# EAGLE design Sensor Tester (EAGLE 9.4.2)
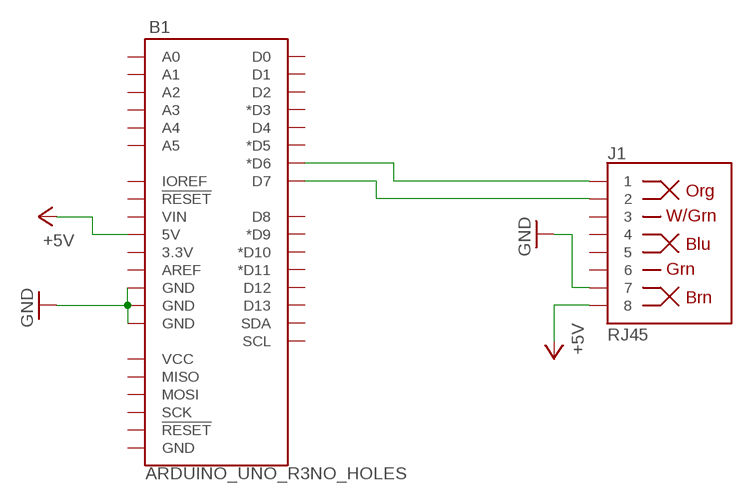
[diagram p0: schematic, sheet 1]

## Parts
B1  ARDUINO_UNO_R3NO_HOLES  [ARDUINO_R3_NO_HOLES]
J1  RJ45  RJ45-8  [RJ45-8]

## Nets
+5V: B1.5V J1.8
GND: B1.GND@2(GND) B1.GND@3(GND) B1.GND@4(GND) J1.7
N$1: B1.D6(*D6) J1.1
N$2: B1.D7 J1.2
Unconnected: B1.3.3V B1.A0 B1.A1 B1.A2 B1.A3 B1.A4 B1.A5 B1.AREF B1.D0 B1.D1 B1.D2 B1.D3(*D3) B1.D4 B1.D5(*D5) B1.D8 B1.D9(*D9) B1.D10(*D10) B1.D11(*D11) B1.D12 B1.D13 B1.GND@1(GND) B1.IOREF B1.MISO B1.MOSI B1.RESET@1(!RESET!) B1.RESET@2(!RESET!) B1.SCK B1.SCL B1.SDA B1.VCC B1.VIN J1.3 J1.4 J1.5 J1.6

## Library data of the parts
B1 = SparkFun-Boards:ARDUINO_UNO_R3: Arduino R3 Footprint with SPI header Arduino Uno R3 Compatible Footprint. Matches PCB size of the original board. SparkFun Products: SAMD21 Dev Breakout <https://www.sparkfun.com/products/13672> RedBoard <https://www.sparkfun.com/products/12757> R3 Stackable Headers <https://www.sparkfun.com/products/11417>
J1 = SparkFun-Connectors:RJ45-8: RJ45 Jack - 8 pin Simple RJ45, 8-pin connection. Commonly used for Cat5, Cat5e, and Cat6 Ethernet cables. Here is the connector we sell at SparkFun: RJ45 8-Pin Connector <https://www.sparkfun.com/products/643> (PRT-00643) Datasheet <https://cdn.sparkfun.com/datasheets/Prototyping/04908.pdf> It is used on this SparkFun product: SparkFun RJ45 Breakout <https://www.sparkfun.com/products/716> (BOB-00716) Note, you may also be interested in the "MAGJACK" version of this. It is basically a RJ45 connector, but also has some status LEDs built into the connector housing. You can check that out in this library at the device named "MAGJACK.dev" and see these products online: RJ45 Ethernet MagJack-Compatible <https://www.sparkfun.com/products/8534> (PRT-08534) SparkFun RJ45 MagJack Breakout <https://www.sparkfun.com/products/13021> (BOB-13021); PROD_ID: CONN-08506; SF_ID: PRT-00643

## Board
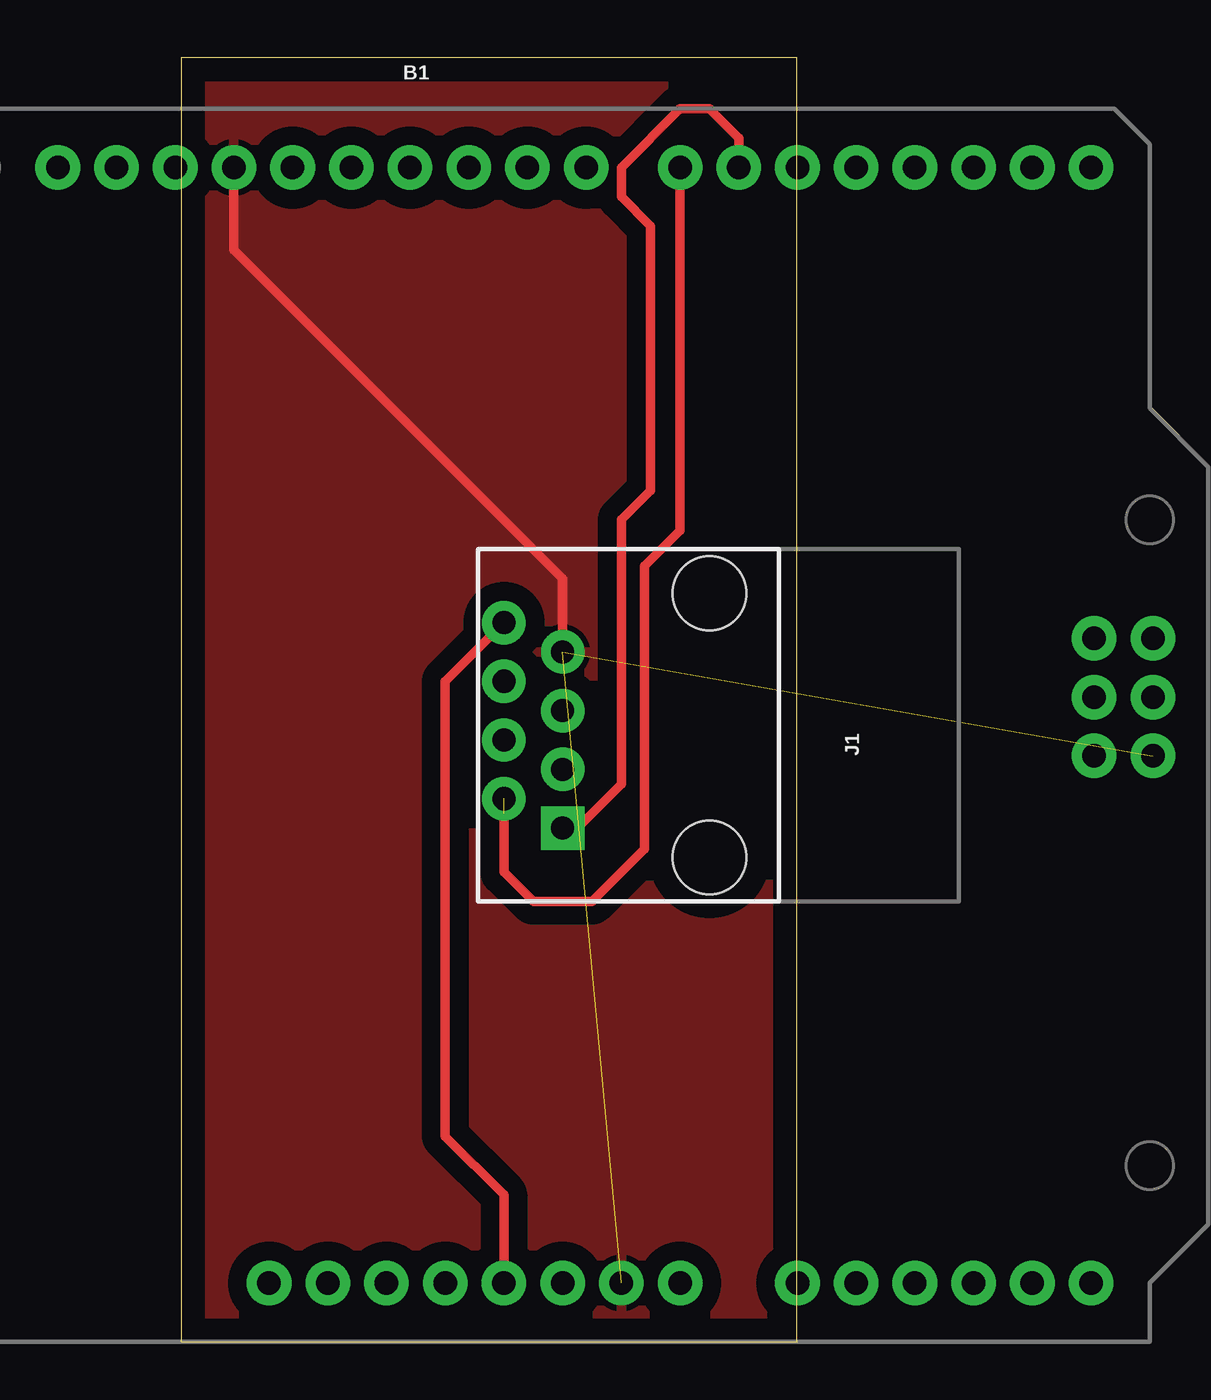
[diagram p1: board, top side]

Size 26.65 x 55.55 mm. Coordinates in mm from the lower left corner, seen from the top.
Outline: 0,0 26.65,0 26.65,55.55 0,55.55 0,0
Copper layers (1*16): Top 0.035mm / dielectric 1.5mm / Bottom 0.035mm
Design rules "default": minimum track width 6mil, minimum drill 0.35mm, track to track 6mil, track to pad 6mil, pad to pad 6mil, via to via 6mil, smd to smd 6mil, copper to edge 40mil, drill to drill 6mil, minimum pad ring 10mil, minimum via ring 8mil, stop-mask expansion 4mil, vias tented up to drill 0mil, thermal gap 10mil

### Footprints (pad centres in the part's own frame; a part is rotated, then mirrored left to right if it is on the bottom)
ARDUINO_R3_NO_HOLES = drill 1.016 pad 1.93: 3.3V 1.27,-24.13; 5V 3.81,-24.13; A0 16.51,-24.13; A1 19.05,-24.13; A2 21.59,-24.13; A3 24.13,-24.13; A4 26.67,-24.13; A5 29.21,-24.13; AREF -10.414,24.13; D0 29.21,24.13; D1 26.67,24.13; D2 24.13,24.13; D3 21.59,24.13; D4 19.05,24.13; D5 16.51,24.13; D6 13.97,24.13; D7 11.43,24.13; D8 7.366,24.13; D9 4.826,24.13; D10 2.286,24.13; D11 -0.254,24.13; D12 -2.794,24.13; D13 -5.334,24.13; GND@1 6.35,-24.13; GND@2 8.89,-24.13; GND@3 -7.874,24.13; GND@4 31.89,-1.32; IOREF -3.81,-24.13; MISO 29.35,3.76; MOSI 31.89,1.22; NC -6.35,-24.13; RESET@1 -1.27,-24.13; RESET@2 29.35,-1.32; SCK 29.35,1.22; SCL -15.494,24.13; SDA -12.954,24.13; VCC 31.89,3.76; VIN 11.43,-24.13
RJ45-8 = drill 1 pad 1.88 square: 1 -4.445,6.35 | drill 1 pad 1.88: 2 -3.175,8.89; 3 -1.905,6.35; 4 -0.635,8.89; 5 0.635,6.35; 6 1.905,8.89; 7 3.175,6.35; 8 4.445,8.89 | hole 3.2: -5.715,0; 5.715,0

### Placement (x,y rotation side)
B1  10.16,26.67 0 top
J1  22.86,26.67 90 top

### Tracks (layer width: path | path; a pad name or v marks a point on that pad's centre or on a via)
+5V
  Top 0.406: J1.8 11.43,28.57 11.43,8.89 13.97,6.35 B1.5V
GND  (2 unrouted)
  Top 0.406: B1.GND@3 2.29,47.24 16.51,33.02 J1.7
  pour Top (isolate 0.813): 0,54.61 0,0 26.67,0 26.67,54.61
N$1
  Top 0.406: J1.1 17.14,22.23 19.05,24.13 19.05,35.56 20.32,36.83 20.32,48.26 19.05,49.53 19.05,50.8 21.59,53.34 22.86,53.34 24.13,52.07 B1.D6
N$2  (1 unrouted)
  Top 0.406: B1.D7 21.59,35.1 20.04,33.55 20.04,21.31 17.78,19.05 15.24,19.05 13.97,20.32 13.97,22.86